# EAGLE design board (EAGLE 9.6.2)
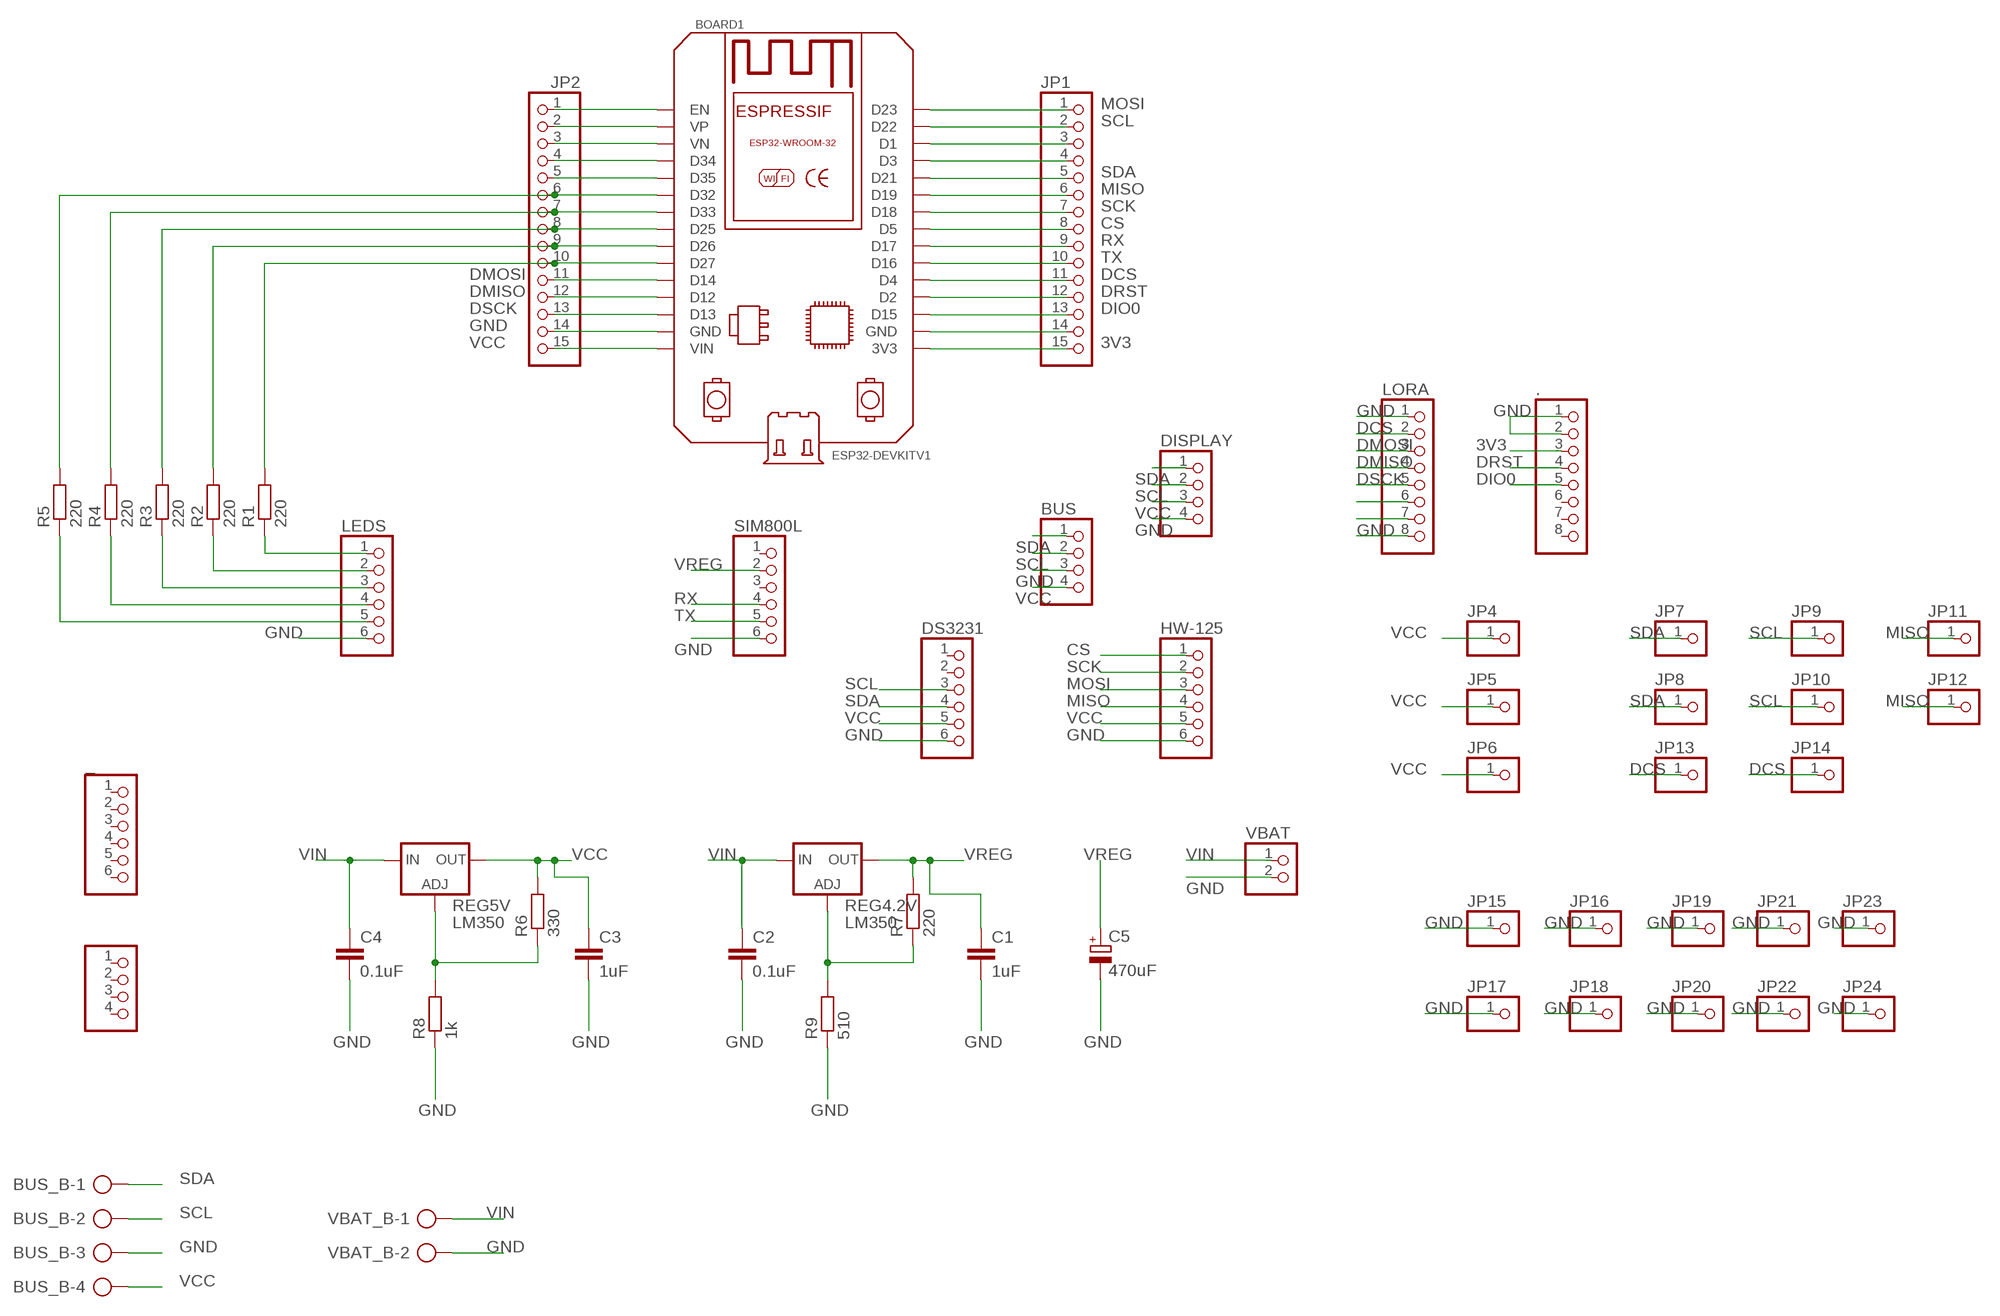
[diagram p0: schematic, sheet 1]

## Parts
.  PINHD-1X8  [1X08]
_  PINHD-1X6  [1X06]
BOARD1  ESP32DEVKITV1  [ESP32-DEVKITV1]
BUS  PINHD-1X4  [1X04]
BUS_B  AK500/4-H  [AK500/4-H]
C1  1uF  C2.5/2  [C2.5-2]
C2  0.1uF  C2.5/2  [C2.5-2]
C3  1uF  C2.5/2  [C2.5-2]
C4  0.1uF  C2.5/2  [C2.5-2]
C5  470uF  CPOL-EUE3.5-8  [E3,5-8]
DISPLAY  PINHD-1X4  [1X04]
DS3231  PINHD-1X6  [1X06]
HW-125  PINHD-1X6  [1X06]
JP1  PINHD-1X15  [1X15]
JP2  PINHD-1X15  [1X15]
JP3  PINHD-1X4  [1X04]
JP4  PINHD-1X1  [1X01]
JP5  PINHD-1X1  [1X01]
JP6  PINHD-1X1  [1X01]
JP7  PINHD-1X1  [1X01]
JP8  PINHD-1X1  [1X01]
JP9  PINHD-1X1  [1X01]
JP10  PINHD-1X1  [1X01]
JP11  PINHD-1X1  [1X01]
JP12  PINHD-1X1  [1X01]
JP13  PINHD-1X1  [1X01]
JP14  PINHD-1X1  [1X01]
JP15  PINHD-1X1  [1X01]
JP16  PINHD-1X1  [1X01]
JP17  PINHD-1X1  [1X01]
JP18  PINHD-1X1  [1X01]
JP19  PINHD-1X1  [1X01]
JP20  PINHD-1X1  [1X01]
JP21  PINHD-1X1  [1X01]
JP22  PINHD-1X1  [1X01]
JP23  PINHD-1X1  [1X01]
JP24  PINHD-1X1  [1X01]
LEDS  PINHD-1X6  [1X06]
LORA  PINHD-1X8  [1X08]
R1  220  R-EU_R1206  [R1206]
R2  220  R-EU_R1206  [R1206]
R3  220  R-EU_R1206  [R1206]
R4  220  R-EU_R1206  [R1206]
R5  220  R-EU_R1206  [R1206]
R6  330  R-EU_0204/7  [0204/7]
R7  220  R-EU_0204/7  [0204/7]
R8  1k  R-EU_0204/7  [0204/7]
R9  510  R-EU_0204/7  [0204/7]
REG4.2V  LM350  LM317TS  [317TS]
REG5V  LM350  LM317TS  [317TS]
SIM800L  PINHD-1X6  [1X06]
VBAT  PINHD-1X2  [1X02]
VBAT_B  AK500/2-H  [AK500/2-H]

## Nets
3V3: ..3 BOARD1.3V3 JP1.15
CS: BOARD1.D5 HW-125.1 JP1.8
DCS: BOARD1.D4 JP1.11 JP13.1 JP14.1 LORA.2
DIO0: ..5 BOARD1.D15 JP1.13
DMISO: BOARD1.D12 JP2.12 LORA.4
DMOSI: BOARD1.D14 JP2.11 LORA.3
DRST: ..4 BOARD1.D2 JP1.12
DSCK: BOARD1.D13 JP2.13 LORA.5
GND: ..1 ..2 BOARD1.GND BUS.3 BUS_B.3 C1.2 C2.2 C3.2 C4.2 C5.- DISPLAY.4 DS3231.6 HW-125.6 JP2.14 JP15.1 JP16.1 JP17.1 JP18.1 JP19.1 JP20.1 JP21.1 JP22.1 JP23.1 JP24.1 LEDS.6 LORA.1 LORA.8 R8.1 R9.1 SIM800L.6 VBAT.2 VBAT_B.2
MISO: BOARD1.D19 HW-125.4 JP1.6 JP11.1 JP12.1
MOSI: BOARD1.D23 HW-125.3 JP1.1
N$1: BOARD1.EN JP2.1
N$2: BOARD1.VP JP2.2
N$3: BOARD1.VN JP2.3
N$4: BOARD1.D34 JP2.4
N$5: BOARD1.D35 JP2.5
N$6: BOARD1.D32 JP2.6 R5.2
N$7: BOARD1.D33 JP2.7 R4.2
N$8: BOARD1.D25 JP2.8 R3.2
N$9: BOARD1.D26 JP2.9 R2.2
N$10: BOARD1.D27 JP2.10 R1.2
N$11: LEDS.1 R1.1
N$13: LEDS.2 R2.1
N$14: LEDS.3 R3.1
N$15: LEDS.4 R4.1
N$16: LEDS.5 R5.1
N$18: BOARD1.D1 JP1.3
N$19: BOARD1.D3 JP1.4
N$20: BOARD1.GND@1(GND) JP1.14
N$21: R6.1 R8.2 REG5V.1(ADJ)
N$22: R7.1 R9.2 REG4.2V.1(ADJ)
N$27: LORA.6
N$29: LORA.7
RX: BOARD1.D17 JP1.9 SIM800L.4
SCK: BOARD1.D18 HW-125.2 JP1.7
SCL: BOARD1.D22 BUS.2 BUS_B.2 DISPLAY.2 DS3231.3 JP1.2 JP9.1 JP10.1
SDA: BOARD1.D21 BUS.1 BUS_B.1 DISPLAY.1 DS3231.4 JP1.5 JP7.1 JP8.1
TX: BOARD1.D16 JP1.10 SIM800L.5
VCC: BOARD1.VIN BUS.4 BUS_B.4 C3.1 DISPLAY.3 DS3231.5 HW-125.5 JP2.15 JP4.1 JP5.1 JP6.1 R6.2 REG5V.2(OUT)
VIN: C2.1 C4.1 REG4.2V.3(IN) REG5V.3(IN) VBAT.1 VBAT_B.1
VREG: C1.1 C5.+ R7.2 REG4.2V.2(OUT) SIM800L.2
Unconnected: ..6 ..7 ..8 _.1 _.2 _.3 _.4 _.5 _.6 DS3231.1 DS3231.2 JP3.1 JP3.2 JP3.3 JP3.4 SIM800L.1 SIM800L.3

## Library data of the parts
. LORA = pinhead:PINHD-1X8: PIN HEADER
_ DS3231 HW-125 LEDS SIM800L = pinhead:PINHD-1X6: PIN HEADER
BOARD1 = ESP32-DEVKITV1:ESP32DEVKITV1: https://github.com/shridattdudhat
BUS DISPLAY JP3 = pinhead:PINHD-1X4: PIN HEADER
BUS_B = con-ptr500:AK500/4-H: CONNECTOR Aug. 2004 / PTR Meßtechnik: Die Bezeichnung der Serie AK505 wurde geändert. Es handelt sich hierbei um AK500 in horizontaler Ausführung.; OC_FARNELL: unknown; OC_NEWARK: unknown
C1-C4 = capacitor-wima:C: CAPACITOR naming: grid - package width
C5 = rcl:CPOL-EU: POLARIZED CAPACITOR, European symbol; SPICEPREFIX: C
JP1 JP2 = pinhead:PINHD-1X15: PIN HEADER
JP4-JP24 = pinhead:PINHD-1X1: PIN HEADER
R1-R9 = rcl:R-EU_: RESISTOR, European symbol; SPICEPREFIX: R
REG4.2V REG5V = v-reg:LM317TS: VOLTAGE REGULATOR
VBAT = pinhead:PINHD-1X2: PIN HEADER
VBAT_B = con-ptr500:AK500/2-H: CONNECTOR Aug. 2004 / PTR Meßtechnik: Die Bezeichnung der Serie AK505 wurde geändert. Es handelt sich hierbei um AK500 in horizontaler Ausführung.; OC_FARNELL: unknown; OC_NEWARK: unknown

## Board
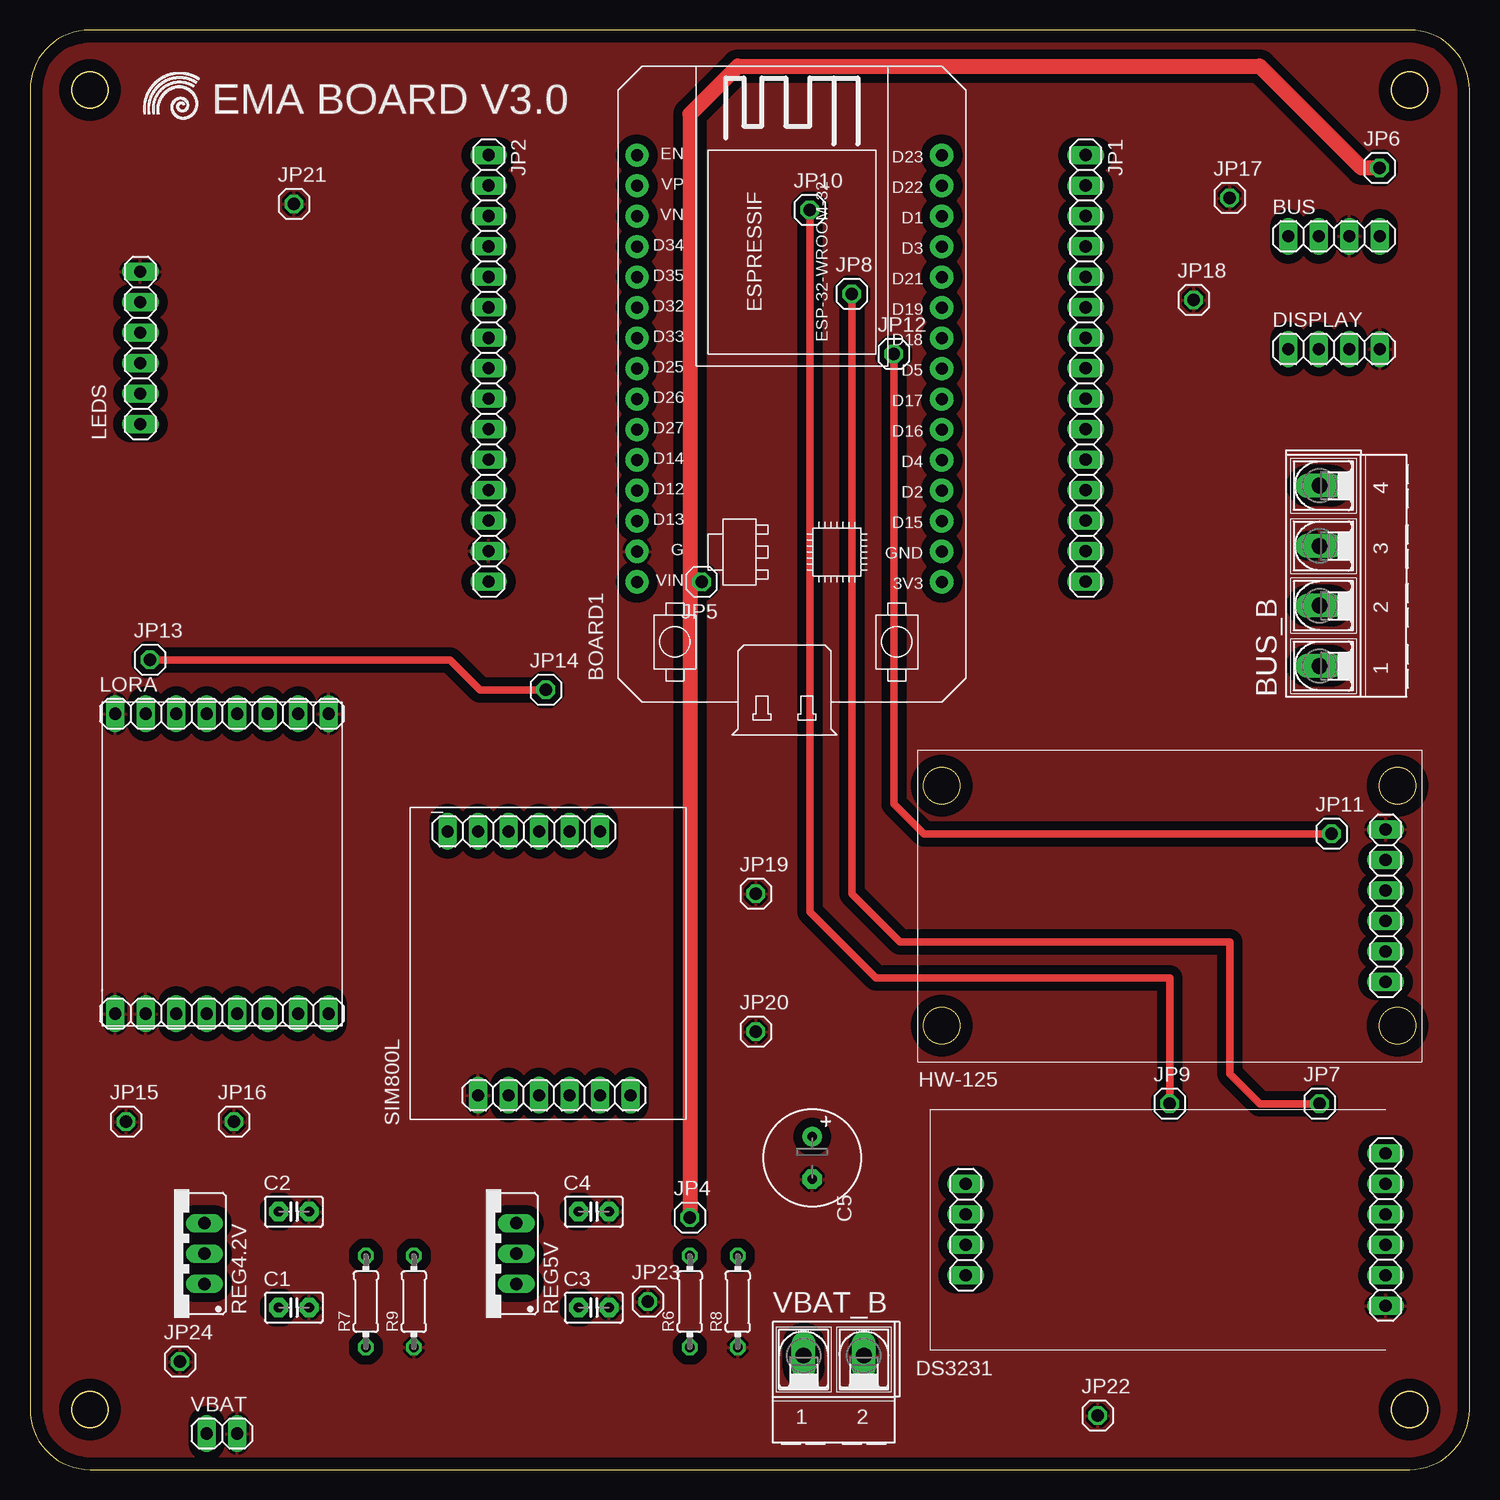
[diagram p1: board, top side]
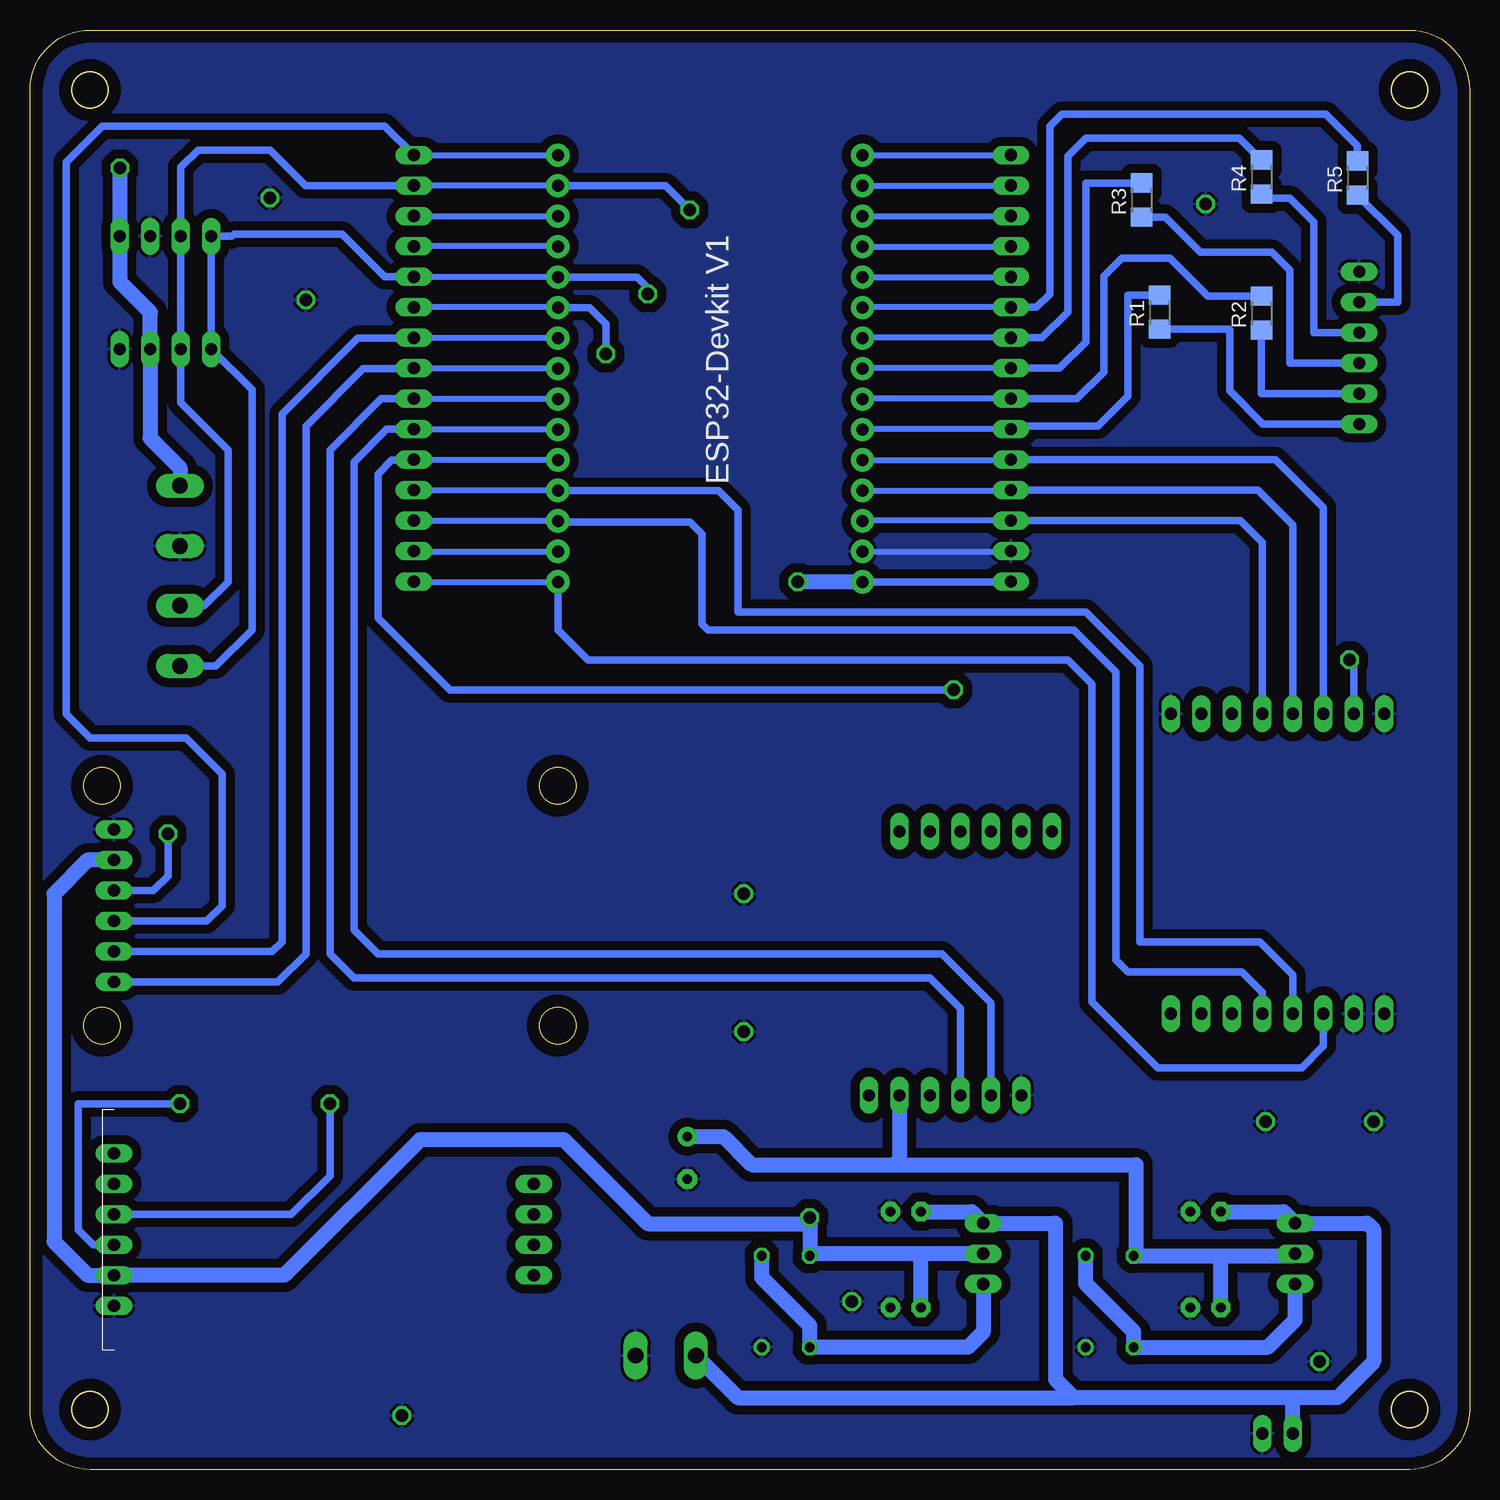
[diagram p2: board, bottom side, seen from below]

Size 120 x 120 mm. Coordinates in mm from the lower left corner, seen from the top.
Outline: 0,115 0,5 arc90 5,0 115,0 arc90 120,5 120,115 arc90 115,120 5,120 arc90 0,115
Outline: circle at 5,115 radius 1.5
Outline: circle at 115,115 radius 1.5
Outline: circle at 5,5 radius 1.5
Outline: circle at 115,5 radius 1.5
Outline: circle at 114,57 radius 1.5
Outline: circle at 114,37 radius 1.5
Outline: circle at 76,37 radius 1.5
Outline: circle at 76,57 radius 1.5
Copper layers (1*16): Top 0.035mm / dielectric 1.5mm / Bottom 0.035mm
Design rules "default *": minimum track width 6mil, minimum drill 0.35mm, track to track 30mil, track to pad 30mil, pad to pad 6mil, via to via 6mil, smd to smd 6mil, copper to edge 40mil, drill to drill 6mil, minimum pad ring 10mil, minimum via ring 8mil, stop-mask expansion 4mil, vias tented up to drill 0mil, thermal gap 10mil

### Footprints (pad centres in the part's own frame; a part is rotated, then mirrored left to right if it is on the bottom)
1X08 = drill 1.016 long: 1 -8.89,0; 2 -6.35,0; 3 -3.81,0; 4 -1.27,0; 5 1.27,0; 6 3.81,0; 7 6.35,0; 8 8.89,0
1X06 = drill 1.016 long: 1 -6.35,0; 2 -3.81,0; 3 -1.27,0; 4 1.27,0; 5 3.81,0; 6 6.35,0
ESP32-DEVKITV1 = drill 1 pad 1.93: 3V3 0,0; D1 30.48,0; D2 7.62,0; D3 27.94,0; D4 10.16,0; D5 17.78,0; D12 7.62,25.4; D13 5.08,25.4; D14 10.16,25.4; D15 5.08,0; D16 12.7,0; D17 15.24,0; D18 20.32,0; D19 22.86,0; D21 25.4,0; D22 33.02,0; D23 35.56,0; D25 17.78,25.4; D26 15.24,25.4; D27 12.7,25.4; D32 22.86,25.4; D33 20.32,25.4; D34 27.94,25.4; D35 25.4,25.4; EN 35.56,25.4; GND 2.54,25.4; GND@1 2.54,0; VIN 0,25.4; VN 30.48,25.4; VP 33.02,25.4
1X04 = drill 1.016 long: 1 -3.81,0; 2 -1.27,0; 3 1.27,0; 4 3.81,0
AK500/4-H = drill 1.321 long: 1 -7.518,0; 2 -2.489,0; 3 2.489,0; 4 7.518,0
C2.5-2 = drill 0.813 pad 1.6 octagon: 1 -1.27,0; 2 1.27,0
E3,5-8 = drill 0.813 pad 1.6: + -1.778,0 | drill 0.813 pad 1.6 octagon: - 1.778,0
1X15 = drill 1.016 long: 1 -17.78,0; 2 -15.24,0; 3 -12.7,0; 4 -10.16,0; 5 -7.62,0; 6 -5.08,0; 7 -2.54,0; 8 0,0; 9 2.54,0; 10 5.08,0; 11 7.62,0; 12 10.16,0; 13 12.7,0; 14 15.24,0; 15 17.78,0
1X01 = drill 1.016 octagon: 1 0,0
R1206 = smd 1.6 x 1.803: 1 -1.422,0; 2 1.422,0
0204/7 = drill 0.813 octagon: 1 -3.81,0; 2 3.81,0
317TS = drill 1.016 long: 1 -2.54,-2.54; 2 0,-2.54; 3 2.54,-2.54
1X02 = drill 1.016 long: 1 -1.27,0; 2 1.27,0
AK500/2-H = drill 1.321 long: 1 -2.515,0; 2 2.515,0

### Placement (x,y rotation side)
.  16,38 0 top
_  41.16,53.2 0 top
BOARD1  76,74 90 top
BUS  108.7,102.8 0 top
BUS_B  107.5,74.5 90 top
C1  22,13.5 0 top
C2  22,21.5 0 top
C3  47,13.5 0 top
C4  47,21.5 0 top
C5  65.2,25.98 270 top
DISPLAY  108.7,93.4 0 top
DS3231  113,20 270 top
HW-125  113,47 90 top
JP1  88,91.8 270 top
JP2  38.23,91.8 270 top
JP3  78,20 90 top
JP4  55,21 0 top
JP5  56,74 180 top
JP6  112.5,108.5 0 top
JP7  107.5,30.5 0 top
JP8  68.5,98 0 top
JP9  95,30.5 0 top
JP10  65,105 0 top
JP11  108.5,53 0 top
JP12  72,93 0 top
JP13  10,67.5 0 top
JP14  43,65 0 top
JP15  8,29 0 top
JP16  17,29 0 top
JP17  100,106 0 top
JP18  97,97.5 0 top
JP19  60.5,48 0 top
JP20  60.5,36.5 0 top
JP21  22,105.5 0 top
JP22  89,4.5 0 top
JP23  51.5,14 0 top
JP24  12.5,9 0 top
LEDS  9.2,93.5 90 top
LORA  16,63 0 top
R1  25.84,96.48 90 bottom
R2  17.34,96.4 90 bottom
R3  27.34,105.82 90 bottom
R4  17.34,107.74 90 bottom
R5  9.34,107.66 90 bottom
R6  55,14 90 top
R7  28,14 90 top
R8  59,14 90 top
R9  32,14 90 top
REG4.2V  12,18 90 top
REG5V  38,18 90 top
SIM800L  43.7,31.2 180 top
VBAT  16,3 0 top
VBAT_B  67,9.5 0 top

### Tracks (layer width: path | path; a pad name or v marks a point on that pad's centre or on a via)
3V3
  Bottom 0.508: JP1.15 87.98,74 BOARD1.3V3
  Bottom 0.61: BOARD1.3V3 76,70 73.5,67.5 33.5,67.5 31.5,65.5 31.5,39 26,33.5 14,33.5 12.19,35.31 ..3
CS
  Bottom 0.508: BOARD1.D5 87.98,91.78 JP1.8
  Bottom 0.61: HW-125.1 99.35,40.65 97,43 97,87 92.22,91.78 87.98,91.78
DCS
  Top 0.61: JP13.1 35,67.5 37.5,65 JP14.1
  Bottom 0.508: BOARD1.D4 87.98,84.16 JP1.11
  Bottom 0.61: 87.98,84.16 89.84,84.16 91,83 91,71 85,65 JP14.1 | LORA.2 9.65,67.15 JP13.1
DIO0
  Bottom 0.508: BOARD1.D15 87.98,79.08 JP1.13
  Bottom 0.61: BOARD1.D15 75.92,79 65,79 64,78 64,70.5 63.5,70 33,70 29.5,66.5 29.5,42.5 28.5,41.5 19,41.5 17.27,39.77 ..5
DMISO
  Bottom 0.508: BOARD1.D12 38.25,81.62 JP2.12
  Bottom 0.61: JP2.12 17.64,81.64 14.73,78.73 LORA.4
DMOSI
  Bottom 0.508: BOARD1.D14 38.25,84.16 JP2.11
  Bottom 0.61: JP2.11 16.18,84.18 12.19,80.19 LORA.3
DRST
  Bottom 0.508: BOARD1.D2 87.98,81.62 JP1.12
  Bottom 0.61: BOARD1.D2 62.62,81.62 61,80 61,71.5 32,71.5 27.5,67 27.5,44 17.5,44 14.73,41.23 ..4
DSCK
  Bottom 0.508: JP2.13 50.58,79.1 BOARD1.D13
  Bottom 0.61: JP2.13 19.1,79.1 17.27,77.27 LORA.5
GND
  Bottom 0.508: BOARD1.GND 38.25,76.54 JP2.14
  pour Top: 115.59,1 4.41,1 arc-90 1,4.41 1,115.59 arc-90 4.41,119 115.59,119 arc-90 119,115.59 119,4.41 arc-90
  pour Bottom: 115.59,1 4.41,1 arc-90 1,4.41 1,115.59 arc-90 4.41,119 115.59,119 arc-90 119,115.59 119,4.41 arc-90
MISO
  Top 0.61: JP11.1 74.5,53 72,55.5 JP12.1
  Bottom 0.508: BOARD1.D19 76.02,96.88 JP1.6
  Bottom 0.61: JP11.1 108.5,49.5 109.73,48.27 HW-125.4 | JP12.1 72,95.5 73.36,96.86 BOARD1.D19
MOSI
  Bottom 0.508: JP1.1 76.02,109.58 BOARD1.D23
  Bottom 0.61: JP1.1 90.42,112 114,112 117,109 117,63 115,61 107,61 104,58 104,47 105.27,45.73 HW-125.3
N$1
  Bottom 0.508: BOARD1.EN 38.25,109.56 JP2.1
N$2
  Bottom 0.508: BOARD1.VP 38.25,107.02 JP2.2
N$3
  Bottom 0.508: BOARD1.VN 38.25,104.48 JP2.3
N$4
  Bottom 0.508: BOARD1.D34 38.25,101.94 JP2.4
N$5
  Bottom 0.508: BOARD1.D35 38.25,99.4 JP2.5
N$6
  Bottom 0.508: JP2.6 50.58,96.88 BOARD1.D32
  Bottom 0.61: JP2.6 36.12,96.88 35,98 35,112 34,113 12,113 9.34,110.34 R5.2
N$7
  Bottom 0.508: JP2.7 50.58,94.34 BOARD1.D33
  Bottom 0.61: JP2.7 35.66,94.34 33.5,96.5 33.5,109.5 32,111 19.18,111 R4.2
N$8
  Bottom 0.508: JP2.8 50.58,91.8 BOARD1.D25
  Bottom 0.61: JP2.8 34.2,91.8 32,94 32,107.24 R3.2
N$9
  Bottom 0.508: JP2.9 50.58,89.26 BOARD1.D26
  Bottom 0.61: R2.2 21.82,97.82 25,101 29,101 30.5,99.5 30.5,91.5 32.74,89.26 JP2.9
N$10
  Bottom 0.508: JP2.10 50.58,86.72 BOARD1.D27
  Bottom 0.61: JP2.10 37.95,87 31,87 28.5,89.5 28.5,97.9 R1.2
N$11
  Bottom 0.61: LEDS.1 17.23,87.15 20,89.92 20,95 20.06,95.06 R1.1
N$13
  Bottom 0.61: R2.1 17.34,89.69 LEDS.2
N$14
  Bottom 0.61: R3.1 25.34,104.4 22.44,101.5 16.5,101.5 15,100 15,92.23 LEDS.3
N$15
  Bottom 0.61: R4.1 17.02,106 15,106 13,104 13,94.77 LEDS.4
N$16
  Bottom 0.61: R5.1 6,102.9 6,97.31 LEDS.5
N$18
  Bottom 0.508: JP1.3 76.02,104.5 BOARD1.D1
N$19
  Bottom 0.508: BOARD1.D3 76.02,101.96 JP1.4
N$20
  Bottom 0.508: JP1.14 87.98,76.54 BOARD1.GND@1
N$21
  Bottom 1.27: REG5V.1 40.54,11.46 41.81,10.19 R6.1 55,12 59,16 R8.2
N$22
  Bottom 1.27: REG4.2V.1 14.54,12.46 16.81,10.19 R7.1 28,11.5 32,15.5 R9.2
RX
  Bottom 0.508: BOARD1.D17 87.98,89.24 JP1.9
  Bottom 0.61: JP1.9 90.74,89.26 95,85 95,43 93,41 45,41 42.43,38.43 SIM800L.4
SCK
  Bottom 0.508: BOARD1.D18 87.98,94.32 JP1.7
  Bottom 0.61: HW-125.2 99.81,43.19 99,44 99,88 92.68,94.32 87.98,94.32
SCL
  Top 0.61: JP9.1 95,41 70.5,41 65,46.5 JP10.1
  Bottom 0.508: BOARD1.D22 87.98,107.02 JP1.2
  Bottom 0.61: JP1.2 97.04,107.04 100,110 106,110 107.43,108.57 BUS.2 DISPLAY.2 107.43,88.93 103.5,85 103.5,74 105.49,72.01 BUS_B.2 | DS3231.3 98.23,21.27 95,24.5 JP9.1 | JP10.1 67.02,107.02 BOARD1.D22
SDA
  Top 0.61: JP7.1 102.5,30.5 100,33 100,44 72.5,44 68.5,48 JP8.1
  Bottom 0.508: JP1.5 76.02,99.42 BOARD1.D21
  Bottom 0.61: JP1.5 90.42,99.42 94,103 103,103 103.2,102.8 BUS.1 DISPLAY.1 101.5,90.01 101.5,70 104.52,66.98 BUS_B.1 | DS3231.4 114.73,18.73 116,20 116,30.5 JP7.1 | BOARD1.D21 69.4,99.4 68.5,98.5 JP8.1
TX
  Bottom 0.508: BOARD1.D16 87.98,86.7 JP1.10
  Bottom 0.61: JP1.10 90.28,86.72 93,84 93,45 91,43 44,43 39.89,38.89 SIM800L.5
VCC
  Top 1.27: JP6.1 111,108.5 102.5,117 59,117 55,113 55,74 | 55,74 JP4.1 | JP5.1 55,74
  Bottom 0.61: BOARD1.VIN 38.25,74 JP2.15
  Bottom 1.27: REG5V.2 46,18 | C3.1 45.73,17.73 46,18 | HW-125.5 115.19,50.81 118,48 118,19 115.19,16.19 DS3231.5 98.81,16.19 87.5,27.5 75.5,27.5 68.5,20.5 55.5,20.5 JP4.1 R6.2 54.81,18 46,18 | BOARD1.VIN JP5.1 | JP6.1 BUS.4 112.51,99.01 109.97,96.47 DISPLAY.3 110,93.37 110,86 107.5,83.5 BUS_B.4
VIN
  Bottom 1.27: C4.1 41.5,21.5 REG5V.3 34.54,20.54 34.5,20.5 34.5,7.5 33,6 | C2.1 15.5,21.5 REG4.2V.3 8.54,20.54 8,20 8,9 11,6 15,6 | 15,6 32,6 33,6 | VBAT.1 14.73,5.73 15,6 | VBAT_B.1 60.98,6 33,6
VREG
  Bottom 1.27: 48,25.4 27.8,25.4 27.8,18.01 R7.2 20.5,17.81 | C5.+ 62.2,27.76 59.84,25.4 48,25.4 | SIM800L.2 47.51,25.89 48,25.4 | REG4.2V.2 14.73,17.81 20.5,17.81 | C1.1 20.73,17.58 20.5,17.81

### Text on the board
tPlace: EMA BOARD V3.0